# EAGLE schematic smart-home.matherboard (EAGLE 9.6.2)
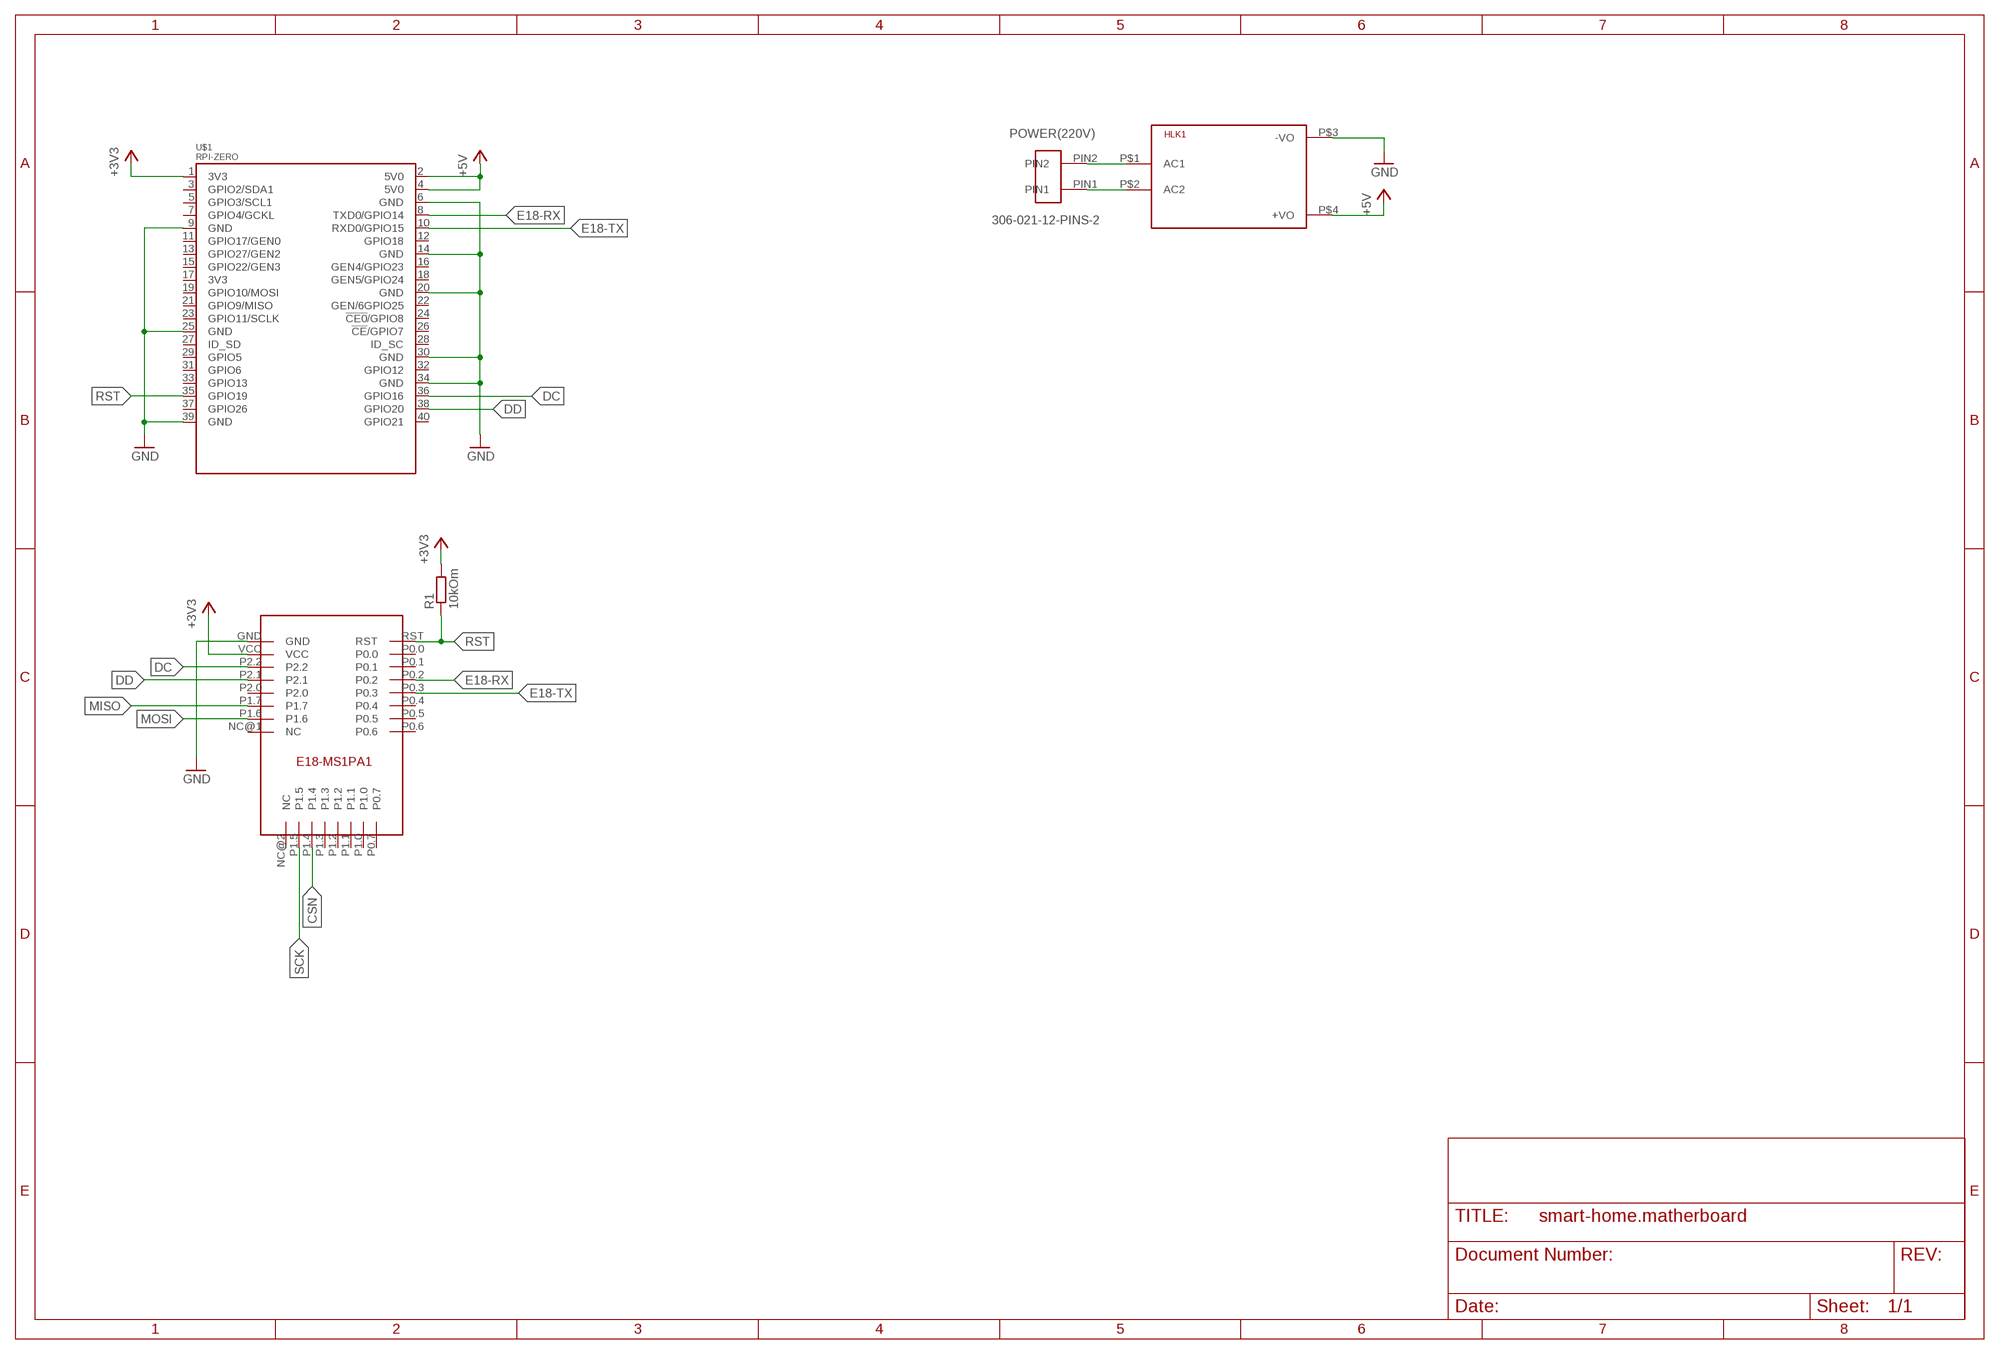
[diagram p0: schematic, sheet 1]

## Parts
HLK1  HLK-PM013W  [HLK-PM01]
POWER(220V)  306-021-12-PINS-2  [SERIA-306-2PIN]
R1  10kOm  R-EU_R0603  [R0603]
U$1  RPI-ZERO  [RASPBERRYPI_BASTELSTUBE_V13_RASPI_BOARD_B+_FULL]
U$3  E18-MS1PA1IPX  [E18-MS1PA1-IPX]

## Nets
+3V3: R1.2 U$1.1(3V3) U$3.VCC
+5V: HLK1.P$4(+VO) U$1.2(5V0) U$1.4(5V0)
CSN: U$3.P1.4
DC: U$1.36(GPIO16) U$3.P2.2
DD: U$1.38(GPIO20) U$3.P2.1
E18-RX: U$1.8(TXD0/GPIO14) U$3.P0.2
E18-TX: U$1.10(RXD0/GPIO15) U$3.P0.3
GND: HLK1.P$3(-VO) U$1.6(GND) U$1.9(GND) U$1.14(GND) U$1.20(GND) U$1.25(GND) U$1.30(GND) U$1.34(GND) U$1.39(GND) U$3.GND
MISO: U$3.P1.7
MOSI: U$3.P1.6
N$1: HLK1.P$1(AC1) POWER(220V).PIN2
N$2: HLK1.P$2(AC2) POWER(220V).PIN1
RST: R1.1 U$1.35(GPIO19) U$3.RST
SCK: U$3.P1.5
Unconnected: U$1.3(GPIO2/SDA1) U$1.5(GPIO3/SCL1) U$1.7(GPIO4/GCKL) U$1.11(GPIO17/GEN0) U$1.12(GPIO18) U$1.13(GPIO27/GEN2) U$1.15(GPIO22/GEN3) U$1.16(GEN4/GPIO23) U$1.17(3V3) U$1.18(GEN5/GPIO24) U$1.19(GPIO10/MOSI) U$1.21(GPIO9/MISO) U$1.22(GEN/6GPIO25) U$1.23(GPIO11/SCLK) U$1.24(!CE0!/GPIO8) U$1.26(!CE!/GPIO7) U$1.27(ID_SD) U$1.28(ID_SC) U$1.29(GPIO5) U$1.31(GPIO6) U$1.32(GPIO12) U$1.33(GPIO13) U$1.37(GPIO26) U$1.40(GPIO21) U$3.NC@1(NC) U$3.NC@2(NC) U$3.P0.0 U$3.P0.1 U$3.P0.4 U$3.P0.5 U$3.P0.6 U$3.P0.7 U$3.P1.0 U$3.P1.1 U$3.P1.2 U$3.P1.3 U$3.P2.0

## Library data of the parts
HLK1 = HLK-PM01:HLK-PM01: Hi-Link Power Supply HLK-PM01 3W Author: Ahmed Said <https://github.com/AhmedSaid/EAGLELibraries>
POWER(220V) = Конекторы:306-021-12
R1 = rcl:R-EU_: RESISTOR, European symbol; SPICEPREFIX: R
U$1 = RPI-Zero:RPI-ZERO
U$3 = e18-ms1pa1-ipx:E18-MS1PA1